# Altium project DCDC.PrjPcb (part 6 of 9)
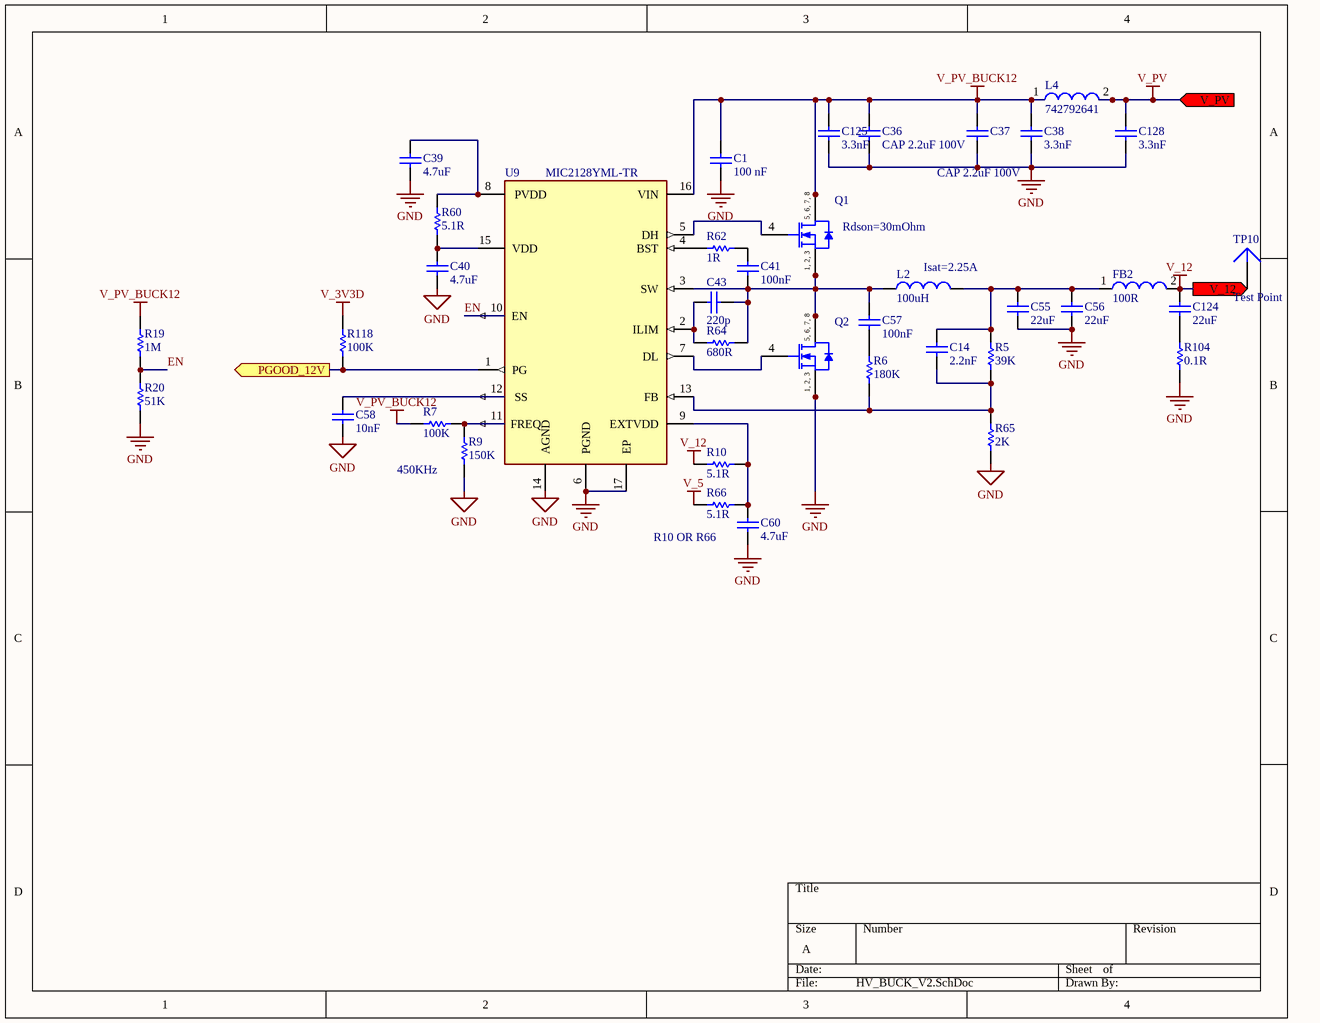
[diagram p12: HV_BUCK_V2.SchDoc]

## Sheet HV_BUCK_V2.SchDoc (continued)

### Library data of the parts (continued)
R62 = CMP-2002-07060-1: ±1% ±400ppm/℃ 1Ω 1/16W 0402 Chip Resistor - Surface Mount ROHS; Manufacturer: Yageo / Phycomp; Part Number: RC0402FR-073R3L; Power Rating: 63mW; Resistance: 3.3R; Temperature Coefficient: 200ppm/°C; Voltage Rating: 50V; Supplier 1: Digi-Key; Supplier Part Number 1: 311-3.30LRCT-ND; Manufacturer Part Number: RC0402FR-073R3L; RoHS: Yes; Category: Chip SMD Resistors; Stock 1: 461211; Pricing 1: 1=0.10000, 10=0.02400, 100=0.00960, 1000=0.00431, 2500=0.00374, 5000=0.00309 (USD); Case/Package: 0402; Case Code (Imperial): 0402; Case Code (Metric): 1005; Contact Plating: Tin,Matte; Size Code: 0402; Min Operating Temperature: -55°C; Max Operating Temperature: 155°C; Tolerance: 1%; Packaging: Tape and Reel; Resistor Type: Thick Film; Series: RC; Max Power Dissipation: 63mW; Number of Terminations: 2; Construction: Rectangular; Voltage Rating (DC): 50V; Features: Moisture Resistant; Termination: SMD/SMT; Resistance Tolerance: 1%; Length: 1mm; Depth: 0.5mm; RoHS Compliant: Yes; Military Standard: Not; Lead Free: Lead Free; REACH SVHC: Unknown; ComponentLink1URL: https://datasheet.ciiva.com/28412/pyu-rc0402-51-rohs-l-6-28412729.pdf?src-supplier=Avnet+Europe; ComponentLink1Description: https://datasheet.ciiva.com/28412/pyu-rc0402-51-rohs-l-6-28412729.pdf?src-supplier=Avnet+Europe; ComponentLink2URL: https://datasheet.ciiva.com/16856/pyu-rc0402-51-rohs-l-6-16856956.pdf?src-supplier=Avnet+Europe; ComponentLink2Description: https://datasheet.ciiva.com/16856/pyu-rc0402-51-rohs-l-6-16856956.pdf?src-supplier=Avnet+Europe; ComponentLink3URL: https://datasheet.ciiva.com/7849/1018594-7849999.pdf?src-supplier=Element14; ComponentLink3Description: https://datasheet.ciiva.com/7849/1018594-7849999.pdf?src-supplier=Element14; ComponentLink4URL: https://datasheet.ciiva.com/8893/pyu-rc0402-51-rohs-l-6-8893711.pdf?src-supplier=Avnet; ComponentLink4Description: https://datasheet.ciiva.com/8893/pyu-rc0402-51-rohs-l-6-8893711.pdf?src-supplier=Avnet; Parameter 1: *; JLCPCB Part #: C25086
R64 = CMP-2002-07842-1: RC-L Series 0402 680 Ohm 0.063 W ±1% ±100 ppm/°C SMT Thick Film Chip Resistor; Manufacturer: Yageo / Phycomp; Part Number: RC0402FR-07953RL; Power Rating: 62.5mW; Voltage Rating: 50V; Max Power Dissipation: 63mW; Supplier 1: Digi-Key; Supplier Part Number 1: YAG3263CT-ND; Manufacturer Part Number: RC0402FR-07953RL; RoHS: Yes; Category: Chip SMD Resistors; Stock 1: 3289; Pricing 1: 1=0.10000, 10=0.01600, 100=0.00660, 1000=0.00299, 2500=0.00259, 5000=0.00214 (USD); Case/Package: 0402; Case Code (Imperial): 0402; Case Code (Metric): 1005; Contact Plating: Tin,Matte; Min Operating Temperature: -55°C; Max Operating Temperature: 155°C; Resistance: 680R; Tolerance: 1%; Packaging: Tape and Reel; Temperature Coefficient: 100ppm/°C; Series: RC; Resistor Type: Thick Film; Voltage Rating (DC): 50V; Number of Terminations: 2; Termination: SMD/SMT; Features: Moisture Resistant; Construction: Rectangular; Length: 1mm; Width: 0.02inch; Height: 0.016inch; Depth: 0.5mm; RoHS Compliant: Yes; Lead Free: Lead Free; Military Standard: Not; ComponentLink1URL: https://datasheet.ciiva.com/16858/pyu-rc0402-51-rohs-l-6-16858058.pdf?src-supplier=Avnet+Europe; ComponentLink1Description: https://datasheet.ciiva.com/16858/pyu-rc0402-51-rohs-l-6-16858058.pdf?src-supplier=Avnet+Europe; ComponentLink2URL: https://datasheet.ciiva.com/28386/pyu-rc0402-51-rohs-l-6-28386955.pdf?src-supplier=Avnet+Europe; ComponentLink2Description: https://datasheet.ciiva.com/28386/pyu-rc0402-51-rohs-l-6-28386955.pdf?src-supplier=Avnet+Europe; ComponentLink3URL: https://datasheet.ciiva.com/12575/pyu-rc0402-51-rohs-l-6-r-8721-12575630.pdf?src-supplier=Mouser; ComponentLink3Description: https://datasheet.ciiva.com/12575/pyu-rc0402-51-rohs-l-6-r-8721-12575630.pdf?src-supplier=Mouser; ComponentLink4URL: https://datasheet.ciiva.com/8884/pyu-rc0402-51-rohs-l-6-8884495.pdf?src-supplier=Avnet; ComponentLink4Description: https://datasheet.ciiva.com/8884/pyu-rc0402-51-rohs-l-6-8884495.pdf?src-supplier=Avnet; Parameter 1: *; JLCPCB Part #: C25130
R65 = CMP-2002-07472-1: 1/16W ±1% 2kΩ ±100ppm/℃ 0402 Chip Resistor - Surface Mount ROHS; Part Number: RC0402FR-071KL; Manufacturer: Yageo / Phycomp; Resistance: 1kR; Power Rating: 62.5mW; Voltage Rating: 50V; Temperature Coefficient: 100ppm/°C; Max Power Dissipation: 63mW; Supplier 1: Digi-Key; Supplier Part Number 1: 311-1.00KLRCT-ND; Manufacturer Part Number: RC0402FR-071KL; RoHS: Yes; Category: Chip SMD Resistors; Stock 1: 21620273; Pricing 1: 1=0.10000, 10=0.01600, 100=0.00660, 1000=0.00299, 2500=0.00259, 5000=0.00214 (USD); Case/Package: 0402; Number of Pins: 2; Case Code (Imperial): 0402; Case Code (Metric): 1005; Size Code: 0402; Min Operating Temperature: -55°C; Max Operating Temperature: 155°C; Packaging: Tape and Reel; Termination: SMD/SMT; Tolerance: 1%; Series: RC; Resistor Type: Thick Film; Number of Terminations: 2; Resistance Tolerance: 1%; Construction: Rectangular; Features: Moisture Resistant; Voltage Rating (DC): 50V; Technology: THICK FILM; Length: 1mm; Width: 0.5mm; Height: 0.32mm; Depth: 0.5mm; REACH SVHC: Unknown; Military Standard: Not; RoHS Compliant: Yes; Lead Free: Lead Free; ComponentLink1URL: https://datasheet.ciiva.com/11819/0900766b80c66297-11819477.pdf?src-supplier=RSComponents; ComponentLink1Description: https://datasheet.ciiva.com/11819/0900766b80c66297-11819477.pdf?src-supplier=RSComponents; ComponentLink2URL: https://datasheet.ciiva.com/12666/pyu-rc0402-51-rohs-l-6-r-12666741.pdf?src-supplier=Mouser; ComponentLink2Description: https://datasheet.ciiva.com/12666/pyu-rc0402-51-rohs-l-6-r-12666741.pdf?src-supplier=Mouser; ComponentLink3URL: https://datasheet.ciiva.com/17063/pyu-rc0402-51-rohs-l-6-r-17063193.pdf?src-supplier=Future+Electronics; ComponentLink3Description: https://datasheet.ciiva.com/17063/pyu-rc0402-51-rohs-l-6-r-17063193.pdf?src-supplier=Future+Electronics; ComponentLink4URL: https://datasheet.ciiva.com/22747/1018594-22747513.pdf?src-supplier=Element14; ComponentLink4Description: https://datasheet.ciiva.com/22747/1018594-22747513.pdf?src-supplier=Element14; ComponentLink5URL: https://datasheet.ciiva.com/7849/1018594-7849869.pdf?src-supplier=Element14; ComponentLink5Description: https://datasheet.ciiva.com/7849/1018594-7849869.pdf?src-supplier=Element14; ComponentLink6URL: https://datasheet.ciiva.com/7983/1018594-7983502.pdf?src-supplier=Element14; ComponentLink6Description: https://datasheet.ciiva.com/7983/1018594-7983502.pdf?src-supplier=Element14; ComponentLink7URL: https://datasheet.ciiva.com/7849/1018594-7849871.pdf?src-supplier=Element14; ComponentLink7Description: https://datasheet.ciiva.com/7849/1018594-7849871.pdf?src-supplier=Element14; Parameter 1: *; JLCPCB Part #: C4109
R104 = CMP-2100-03667-1: Chip Resistor, 0 Ohm, +/- 5%, 0.1 W, -55 to 155 degC, 0603 (1608 Metric), RoHS, Tape and Reel; Manufacturer: Yageo; Manufacturer Part Number: RC0603JR-070RL; Temperature Coefficient: 200ppm/degreesC; Voltage Rating: 50V; Power Rating: 100mW; Resistance: 0mOhm; Width: 0.8mm; Max Operating Temperature: 155degC; Tolerance: 5%; Package Reference: 0603; Height: 0.45mm; Depth: 0.8mm; Package Description: 2-Pin Surface Mount Device, Body 1.6 x 0.8 mm; Termination: SMD/SMT; Package Quantity: 5000; Case/Package: 0603; Case Code (Imperial): 0603; Radiation Hardening: No; Number of Pins: 2; Length: 1.6mm; Lead Free: LeadFree; Voltage Rating (DC): 50V; Military Standard: Not; Datasheet URL: http://www.yageo.com/NewPortal/yageodocoutput?fileName=/pdf/R-Chip/PYu-RC_Group_51_RoHS_L_5.pdf; Manufacturer URL: http://www.yageo.com/; Packaging: TapeandReel; Case Code (Metric): 1608; Min Operating Temperature: -55degC; Composition: ThickFilm; RoHSCompliant: true; Contact Plating: Tin; Datasheet Version: Rev. 5, 10/2016; REACH SVHC: NoSVHC; Supplier 1: Digi-Key; Supplier Part Number 1: 311-0.0GRCT-ND; RoHS: Yes; Category: Chip SMD Resistors; Stock 1: 3784489; Pricing 1: 1=0.10000, 10=0.01700, 25=0.01240, 50=0.00940, 100=0.00700, 250=0.00532, 500=0.00424, 1000=0.00313 (USD); Size Code: 0603; Resistor Type: Thick Film; Series: RC; Max Power Dissipation: 100mW; Construction: Rectangular; Number of Terminations: 2; Features: Moisture Resistant; Technology: THICK FILM; Resistance Tolerance: 5%; RoHS Compliant: Yes; ComponentLink1URL: https://datasheet.ciiva.com/11808/pyu-r-int-6-11808700.pdf?src-supplier=RSComponents; ComponentLink1Description: https://datasheet.ciiva.com/11808/pyu-r-int-6-11808700.pdf?src-supplier=RSComponents; ComponentLink2URL: https://datasheet.ciiva.com/22747/443971-22747530.pdf?src-supplier=Element14; ComponentLink2Description: https://datasheet.ciiva.com/22747/443971-22747530.pdf?src-supplier=Element14; ComponentLink3URL: https://datasheet.ciiva.com/12555/rc0603-272842-12555254.pdf?src-supplier=Mouser; ComponentLink3Description: https://datasheet.ciiva.com/12555/rc0603-272842-12555254.pdf?src-supplier=Mouser; ComponentLink4URL: https://datasheet.ciiva.com/7746/1738695-7746421.pdf?src-supplier=Element14; ComponentLink4Description: https://datasheet.ciiva.com/7746/1738695-7746421.pdf?src-supplier=Element14; ComponentLink5URL: https://datasheet.ciiva.com/7746/1738695-7746422.pdf?src-supplier=Element14; ComponentLink5Description: https://datasheet.ciiva.com/7746/1738695-7746422.pdf?src-supplier=Element14; ComponentLink6URL: https://datasheet.ciiva.com/8883/pyu-rc0603-51-rohs-l-4-8883045.pdf?src-supplier=Avnet; ComponentLink6Description: https://datasheet.ciiva.com/8883/pyu-rc0603-51-rohs-l-4-8883045.pdf?src-supplier=Avnet; ComponentLink7URL: https://datasheet.ciiva.com/15189/getdatasheetpartid-329462-15189845.pdf?src-supplier=Verical; ComponentLink7Description: https://datasheet.ciiva.com/15189/getdatasheetpartid-329462-15189845.pdf?src-supplier=Verical; Parameter 1: *; JLCPCB Part #: *
TP10 = Test_Point 1.5mm round: Round Test Point; LatestRevisionDate: 17-Jul-2002; LatestRevisionNote: Re-released for DXP Platform.; Publisher: Altium Limited; Parameter 1: *; JLCPCB Part #: *
U9 = MIC2128YML-TR: Integrated Circuit; Manufacturer_Name: Microchip; Datasheet Link: https://componentsearchengine.com/Datasheets/1/MIC2128YML-TR.pdf; Height: 0.9mm; Manufacturer_Part_Number: MIC2128YML-TR; Mouser Part Number: 579-MIC2128YML-TR; Mouser Price/Stock: https://www.mouser.co.uk/ProductDetail/Microchip-Technology/MIC2128YML-TR?qs=NoqMqJKvPFLnUo4QxJcPkw%3D%3D; Arrow Part Number: MIC2128YML-TR; Arrow Price/Stock: https://www.arrow.com/en/products/mic2128yml-tr/microchip-technology; Parameter 1: *; JLCPCB Part #: *

## Sheet LV_BUCK.SchDoc
size A; SheetNumber: 6; SheetTotal: 8
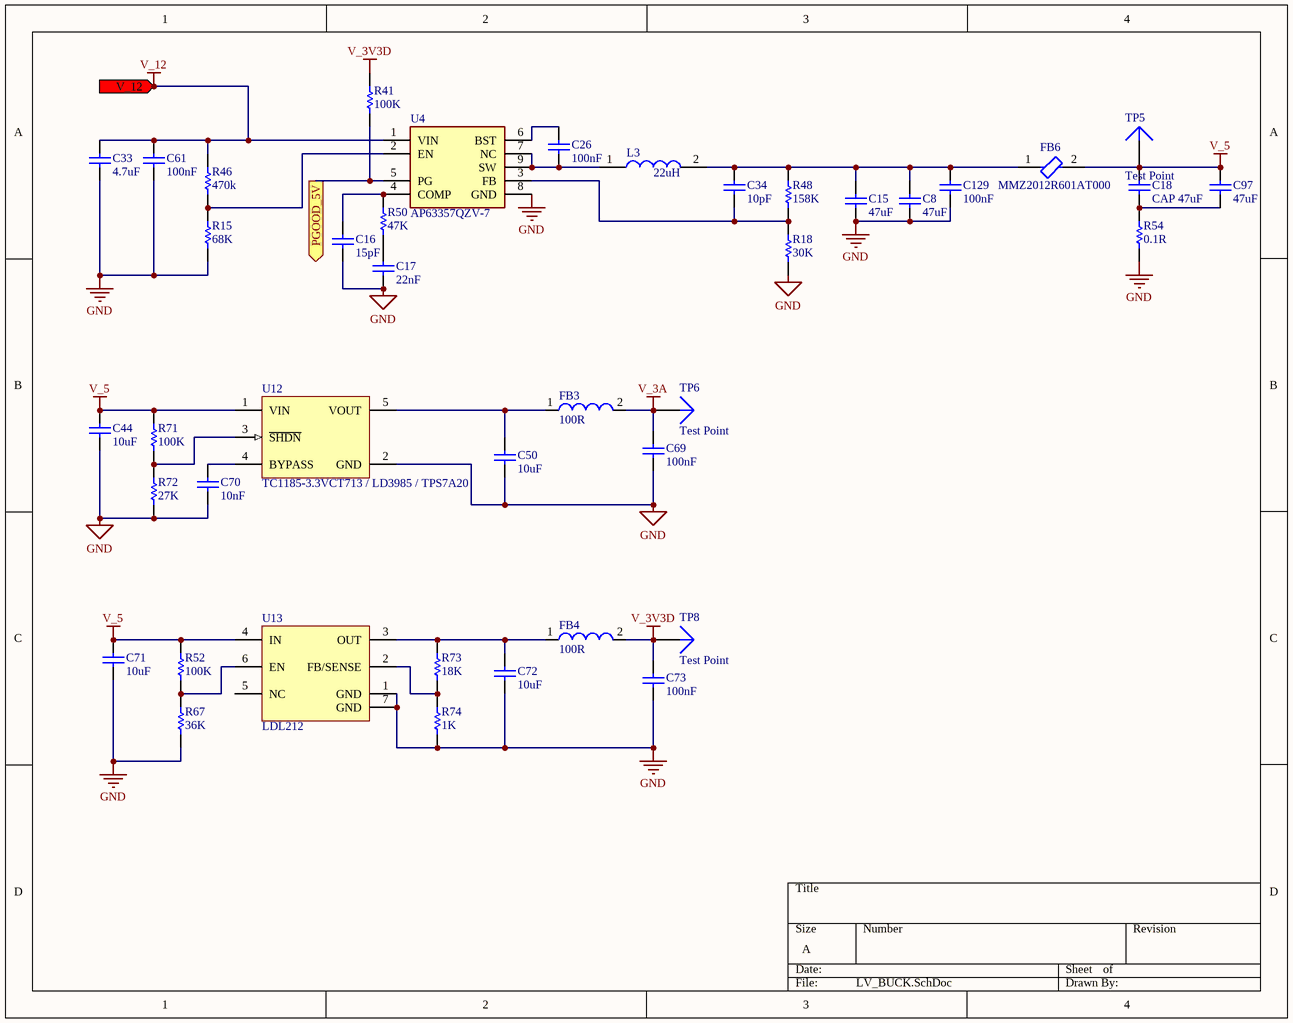
[diagram p6: LV_BUCK.SchDoc]

### Parts
C8  47uF  [CAPC1206(3216)190_N]
C15  47uF  [CAPC1206(3216)190_N]
C16  15pF  [CAPC1005X56X25NL10T15]
C17  22nF  [CAPC1005X56X25NL10T15]
C18  CAP 47uF  [CAPC1210(3225)280_M]
C26  100nF  [CAPC1005X56X25NL10T15]
C33  4.7uF  [CAPC3216X180X50NL20T25]
C34  10pF  [CAPC1005X56X25NL10T15]
C44  10uF  [CAPC2013X140X45NL15T25]
C50  10uF  [CAPC2013X140X45NL15T25]
C61  100nF  [CAPC1608X90X35NL10T15]
C69  100nF  [CAPC1608X90X35NL10T15]
C70  10nF  [CAPC1608X90X35NL10T15]
C71  10uF  [CAPC2013X140X45NL15T25]
C72  10uF  [CAPC2013X140X45NL15T25]
C73  100nF  [CAPC1608X90X35NL10T15]
C97  47uF  [CAPC1206(3216)190_N]
C129  100nF  [CAPC1005X56X25NL10T15]
FB3  100R  [SMD-0603]
FB4  100R  [SMD-0603]
FB6  MMZ2012R601AT000  [FP-MMZ2012-IPC_A]
L3  22uH  [INDPM8680X400N]
R15  68K  [RESC1005X40X25NL05T05]
R18  30K  [RESC1005X40X25NL05T05]
R41  100K  [RESC1005X40X25NL05T10]
R46  470k  [RESC1005X40X25NL05T05]
R48  158K  [RESC1005X40X25NL05T05]
R50  47K  [RESC1005X40X25NL05T05]
R52  100K  [RESC1608X55X25NL10T15]
R54  0.1R  [RESC1608X55X25ML10T15]
R67  36K  [RESC1608X55X25NL10T15]
R71  100K  [RESC1608X55X25NL10T15]
R72  27K  [RESC1608X55X25NL10T15]
R73  18K  [RESC1608X55X30NL20T20]
R74  1K  [RESC1608X55X30NL15T15]
TP5  Test Point  [TP1.5mm]
TP6  Test Point  [TP1.5mm]
TP8  Test Point  [TP1.5mm]
U4  AP63357QZV-7  [AP63357QZV7]
U12  TC1185-3.3VCT713 / LD3985 / TPS7A20  [SOT23-5]
U13  LDL212  [LDL212PUR]

### Ports
PGOOD_5V (out), V_12 (in)

### Nets
GND: C8.1 C15.1 C16.1 C17.1 C33.1 C44.1 C50.1 C61.1 C69.1 C70.1 C71.1 C72.1 C73.1 C129.1 R15.1 R18.1 R54.1 R67.1 R72.1 R74.1 U4.8(GND) U12.2(GND) U13.1(GND) U13.7(GND)
V_3A: C69.2 FB3.2 TP6.1
V_3V3D: C73.2 FB4.2 R41.2 TP8.1
V_5: C18.2 C44.2 C71.2 C97.2 FB6.2 R52.2 R71.2 TP5.1 U12.1(VIN) U13.4(IN)
V_12: C33.2 C61.2 R46.2 U4.1(VIN) ; port V_12
NetC8_2: C8.2 C15.2 C34.2 C129.2 FB6.1 L3.2 R48.2
NetC16_2: C16.2 R50.2 U4.4(COMP)
NetC17_2: C17.2 R50.1
NetC18_1: C18.1 C97.1 R54.2
NetC26_1: C26.1 L3.1 U4.7(NC) U4.9(SW)
NetC26_2: C26.2 U4.6(BST)
NetC34_1: C34.1 R18.2 R48.1 U4.3(FB)
NetC50_2: C50.2 FB3.1 U12.5(VOUT)
NetC70_2: C70.2 U12.4(BYPASS)
NetC72_2: C72.2 FB4.1 R73.2 U13.3(OUT)
NetR15_2: R15.2 R46.1 U4.2(EN)
NetR41_1: R41.1 U4.5(PG) ; port PGOOD_5V
NetR52_1: R52.1 R67.2 U13.6(EN)
NetR71_1: R71.1 R72.2 U12.3(~{SHDN})
NetR73_1: R73.1 R74.2 U13.2(FB/SENSE)

Not connected (* = marked no-connect by the designer): U13 5(NC)